# Altium schematic sheet CPU_AV.SchDoc
size A3; SheetNumber: 21; SheetTotal: 21
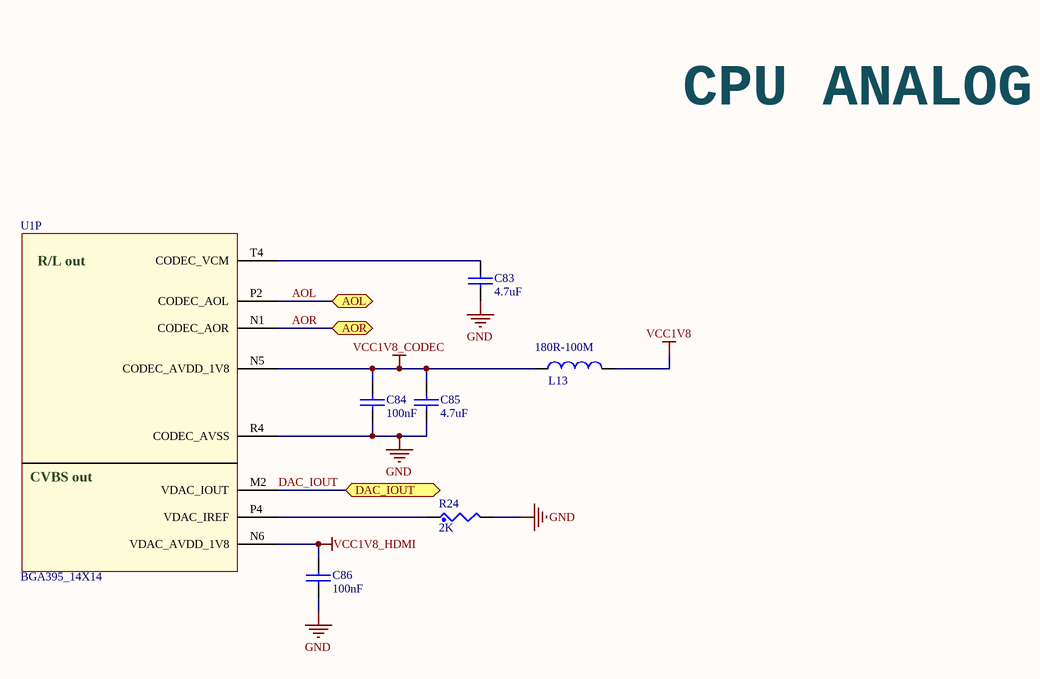
[diagram p0: CPU_AV.SchDoc]

## Parts
C83  4.7uF  [0402_CC - C]
C84  100nF  [0402_CC - C]
C85  4.7uF  [0402_CC - C]
C86  100nF  [0402_CC - C]
L13  180R-100M  [0603_C_Inductor]
R24  2K  [0402_CR]
U1  BGA395_14X14  [BGA395C65P21X21_1750X1750X117]  (part P of 17)

## Ports
AOL (bidir), AOR (bidir), DAC_IOUT (bidir)

## Nets
GND: C83.2 C84.2 C85.2 C86.2 R24.2 U1.R4(CODEC_AVSS)
VCC1V8: L13.2
VCC1V8_CODEC: C84.1 C85.1 L13.1 U1.N5(CODEC_AVDD_1V8)
VCC1V8_HDMI: C86.1 U1.N6(VDAC_AVDD_1V8)
AOL: U1.P2(CODEC_AOL) ; port AOL
AOR: U1.N1(CODEC_AOR) ; port AOR
DAC_IOUT: U1.M2(VDAC_IOUT) ; port DAC_IOUT
NetC83_1: C83.1 U1.T4(CODEC_VCM)
NetR24_1: R24.1 U1.P4(VDAC_IREF)

## Notes on the sheet
- CPU ANALOG
- (in symbol RK3328, part P) R/L out; CVBS out

## Library data of the parts
C83-C86 = CAP_NP: CLASS: DISCRETE
L13 = INDCHIP: Fixed Inductors  TDK, By AAR
R24 = RES: CLASS: DISCRETE
U1 = RK3328: By AAR